# EAGLE design v1 USB_UART (EAGLE 9.7.0)
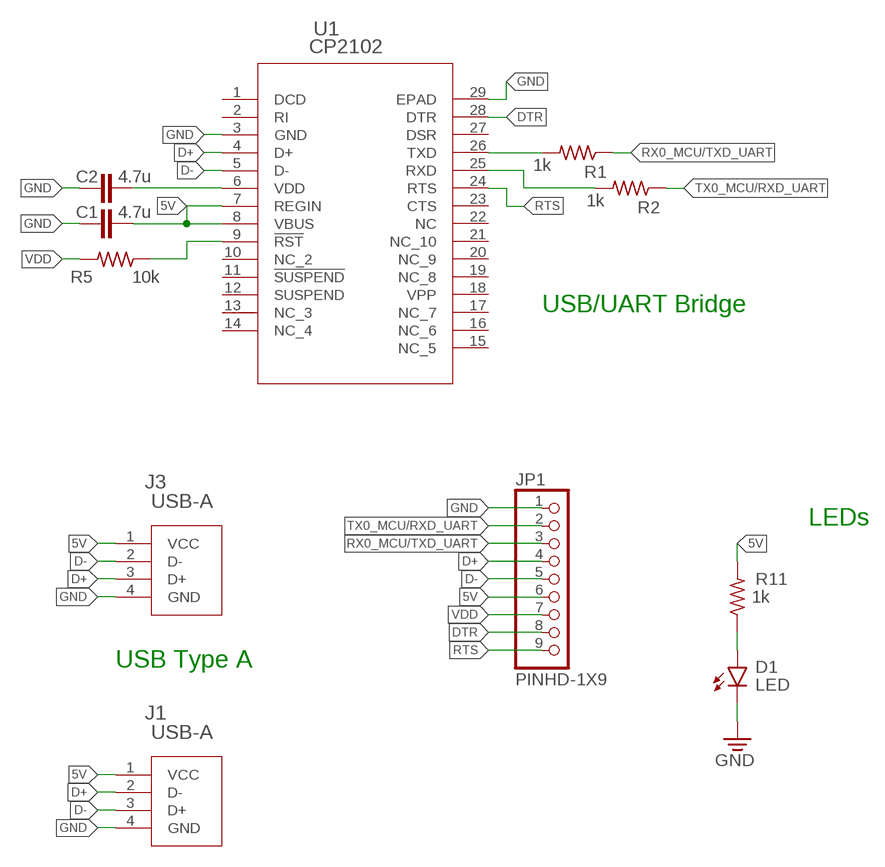
[diagram p0: schematic, sheet 1]

## Parts
C1  4.7u  C_CHIP-0805(2012-METRIC)  [CAPC2012X110]
C2  4.7u  C_CHIP-0805(2012-METRIC)  [CAPC2012X110]
D1  LED  CHIP-FLAT-B_0805  [LEDC2012X110N_FLAT-B]
J1  USB-A  USB-A1VSB6_OST  [USB-A]
J3  USB-A  USB-A1VSB6_OST  [USB-A]
JP1  PINHD-1X9  [1X09]
R1  1k  R-US_CHIP-0805(2012-METRIC)  [RESC2012X65]
R2  1k  R-US_CHIP-0805(2012-METRIC)  [RESC2012X65]
R5  10k  R-US_CHIP-0805(2012-METRIC)  [RESC2012X65]
R11  1k  R-US_CHIP-0805(2012-METRIC)  [RESC2012X65]
U1  CP2102  CP2102-GMQFN28_5X5_SIL  [QFN28_5X5_SIL]

## Nets
5V: C1.2 J1.1(VCC) J3.1(VCC) JP1.6 R11.2 U1.7(REGIN) U1.8(VBUS)
D+: J1.2(D-) J3.3(D+) JP1.4 U1.4(D+)
D-: J1.3(D+) J3.2(D-) JP1.5 U1.5(D-)
DTR: JP1.8 U1.28(DTR)
GND: C1.1 C2.1 D1.C J1.4(GND) J3.4(GND) JP1.1 U1.3(GND) U1.29(EPAD)
N$1: D1.A R11.1
N$5: R5.1 U1.9(!RST)
RTS: JP1.9 U1.24(RTS)
RX0_MCU/TXD_UART: JP1.3 R1.1
RXD: R2.2 U1.25(RXD)
TX0_MCU/RXD_UART: JP1.2 R2.1
TXD: R1.2 U1.26(TXD)
VDD: C2.2 JP1.7 R5.2 U1.6(VDD)
Unconnected: U1.1(DCD) U1.2(RI) U1.10(NC_2) U1.11(!SUSPEND) U1.12(SUSPEND) U1.13(NC_3) U1.14(NC_4) U1.15(NC_5) U1.16(NC_6) U1.17(NC_7) U1.18(VPP) U1.19(NC_8) U1.20(NC_9) U1.21(NC_10) U1.22(NC) U1.23(CTS) U1.27(DSR)

## Notes on the sheet
- USB/UART Bridge
- LEDs
- USB Type A

## Library data of the parts
C1 C2 = Capacitor:C: Capacitor - Generic; CATEGORY: Capacitor
D1 = LED:CHIP-FLAT-B; CATEGORY: LED; COLOR: BLUE; DESCRIPTION: CHIP LED FLAT; SUB-CATEGORY: CHIP; TYPE: FLAT_TOP; VALUE: LED_BLUE
J1 J3 = SD-SolderSync-Library:USB-A; COPYRIGHT: Copyright (C) 2025 Ultra Librarian. All rights reserved.; MANUFACTURER_PART_NUMBER: USB-A1VSB6; MFR_NAME: On Shore Technology
JP1 = Connector:PINHD-1X9: PIN HEADER; CATEGORY: Headers; DESCRIPTION: Header-Straight-9 Position; PACKAGE_TYPE: THT; PITCH: 0.100" (2.54mm); SUBCATEGORY: Headers-Male Pins; TYPE: Board to Board or Cable-Unshrouded-Through Hole-Straight
R1 R2 R5 R11 = Resistor:R-US: Resistor Fixed - ANSI; CATEGORY: Resistor; SUB-CATEGORY: Fixed
U1 = SD-SolderSync-Library:CP2102-GM; COPYRIGHT: Copyright (C) 2025 Ultra Librarian. All rights reserved.; MANUFACTURER_PART_NUMBER: CP2102-GM; MFR_NAME: Silicon Labs

## Board
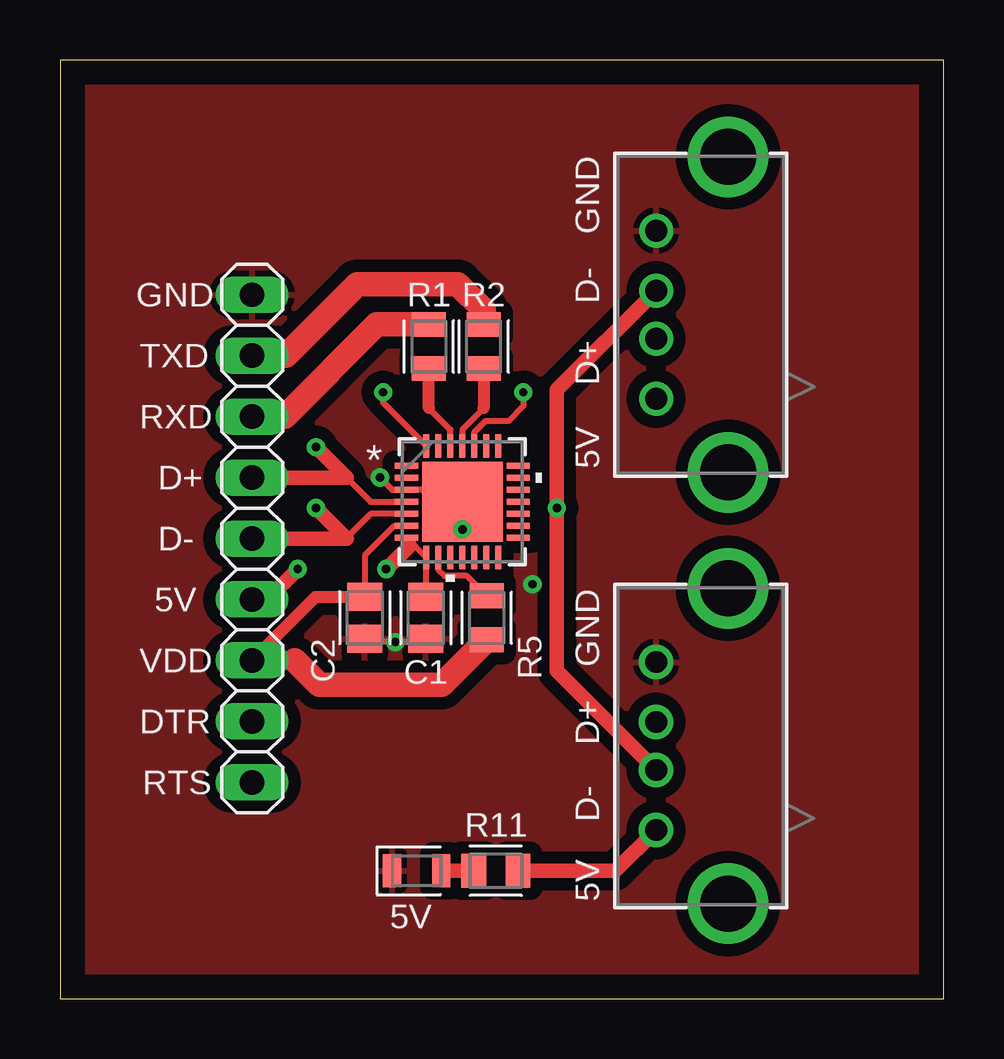
[diagram p1: board, top side]
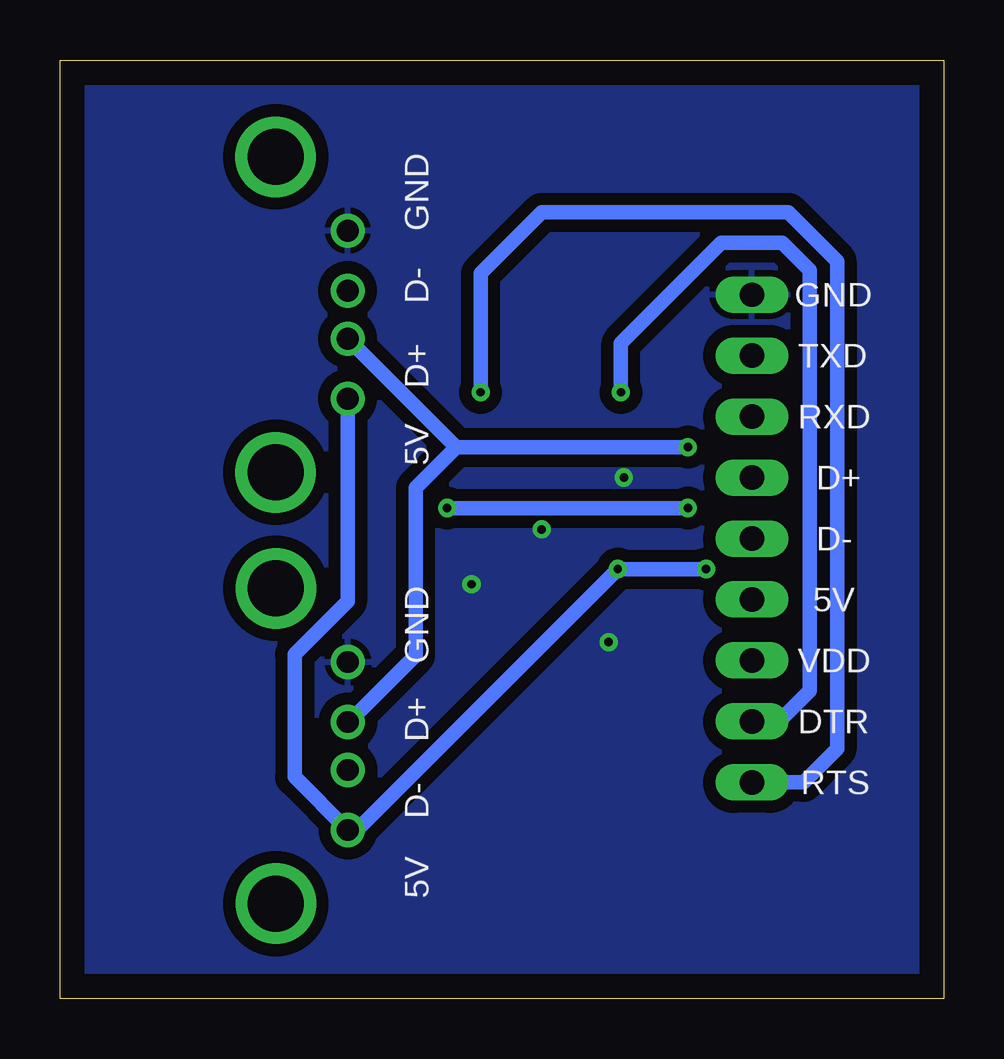
[diagram p2: board, bottom side, seen from below]

Size 36.83 x 39.12 mm. Coordinates in mm from the lower left corner, seen from the top.
Outline: 0,0 36.83,0 36.83,39.12 0,39.12 0,0
Copper layers (1*16): Top 0.035mm / dielectric 1.5mm / Bottom 0.035mm
Design rules "Fusion Electronics Design Rules": minimum track width 6mil, minimum drill 0.35mm, track to track 6mil, track to pad 6mil, pad to pad 6mil, via to via 6mil, smd to smd 6mil, copper to edge 40mil, drill to drill 6mil, minimum pad ring 10mil, minimum via ring 8mil, stop-mask expansion 4mil, vias tented up to drill 0mil, thermal gap 10mil

### Footprints (pad centres in the part's own frame; a part is rotated, then mirrored left to right if it is on the bottom)
CAPC2012X110 = smd 1.165 x 1.465: 1 -0.875,0; 2 0.875,0
LEDC2012X110N_FLAT-B = smd 0.762 x 1.362: A 1.025,0; C -1.025,0
USB-A = drill 0.914 pad 1.422: 1 0,0; 2 2.5,0; 3 4.5,0; 4 7,0 | drill 2.337 pad 2.845: 6 -3.07,-3; 7 10.07,-3
1X09 = drill 1.016 long: 1 -10.16,0; 2 -7.62,0; 3 -5.08,0; 4 -2.54,0; 5 0,0; 6 2.54,0; 7 5.08,0; 8 7.62,0; 9 10.16,0
RESC2012X65 = smd 1.031 x 1.42: 1 -0.919,0; 2 0.919,0
QFN28_5X5_SIL = smd 0.965 x 0.254: 1 -2.324,1.5; 2 -2.324,1; 3 -2.324,0.5; 4 -2.324,0; 5 -2.324,-0.5; 6 -2.324,-1; 7 -2.324,-1.5; 15 2.324,-1.5; 16 2.324,-1; 17 2.324,-0.5; 18 2.324,0; 19 2.324,0.5; 20 2.324,1; 21 2.324,1.5 | smd 0.254 x 0.965: 8 -1.5,-2.324; 9 -1,-2.324; 10 -0.5,-2.324; 11 0,-2.324; 12 0.5,-2.324; 13 1,-2.324; 14 1.5,-2.324; 22 1.5,2.324; 23 1,2.324; 24 0.5,2.324; 25 0,2.324; 26 -0.5,2.324; 27 -1,2.324; 28 -1.5,2.324 | smd 3.353 x 3.353: 29 0,0

### Placement (x,y rotation side)
C1  15.24,15.88 90 top
C2  12.7,15.88 90 top
D1  14.86,5.33 0 top
J1  24.84,25.01 90 top
J3  24.84,7.03 90 top
JP1  8,19.18 270 top
R1  15.37,27.18 270 top
R2  17.65,27.18 270 top
R5  17.78,15.88 270 top
R11  18.16,5.33 0 top
U1  16.76,20.71 0 top

### Tracks (layer width: path | path; a pad name or v marks a point on that pad's centre or on a via)
5V  (via drill 0.35)
  Top 0.254: C1.2 15.26,16.77 U1.8 U1.7 14.57,19.08 14.57,18.88
  Top 0.61: v9.91,17.91 8.64,16.64 JP1.6 | v13.59,17.91 14.57,18.88 | R11.2 23.14,5.33 J3.1
  Bottom 0.61: v9.91,17.91 v13.59,17.91 24.46,7.03 J3.1 27.05,9.25 27.05,14.35 24.84,16.56 J1.1
D+  (via drill 0.35)
  Top 0.254: U1.4 12.95,20.71 11.94,21.72
  Top 0.61: JP1.4 11.94,21.72 v10.67,22.99
  Bottom 0.61: 20.32,22.99 J1.2 | 20.32,22.99 v10.67,22.99 | J3.3 24.79,11.53 22.02,14.31 22.02,21.29 20.32,22.99
D-  (via drill 0.35)
  Top 0.254: U1.5 12.95,20.21 11.94,19.2 11.94,19.18
  Top 0.61: JP1.5 11.94,19.18 v10.67,20.45 | J3.2 20.7,13.67 v20.7,20.45 20.7,25.37 J1.3
  Bottom 0.61: v20.7,20.45 v10.67,20.45
DTR  (via drill 0.35)
  Top 0.254: U1.28 13.46,24.84 v13.46,25.27
  Bottom 0.61: v13.46,25.27 13.46,27.3 9.27,31.5 6.73,31.5 5.59,30.35 5.59,12.83 6.86,11.56 JP1.8
GND  (via drill 0.35)
  Top 0.254: v13.34,21.72 13.84,21.21 U1.3 15.33,21.21 | C2.1 12.83,14.87 13.96,14.87 v13.97,14.86 15.1,14.86 C1.1
  Top 0.508: U1.29 v16.76,19.56
  Top 0.61: U1.29 15.83,20.71 15.33,21.21
  other vias: 19.68,17.27
  pour Bottom (isolate 0.508): 1.07,-3.3 37.79,-3.3 41.91,0.81 41.91,35.89 36.9,40.89 0.18,40.89 -3.94,36.78 -3.94,1.7
  pour Top (isolate 0.508): 1.58,-2.03 37.54,-2.03 40.77,1.2 40.77,35.25 36.14,39.88 0.56,39.88 -2.54,36.78 -2.54,2.08
N$1
  Top 0.61: D1.A R11.1
N$5
  Top 0.254: R5.1 16.95,17.62 16.02,17.62 15.76,17.88 U1.9
RTS  (via drill 0.35)
  Top 0.254: U1.24 17.26,23.61 17.72,24.07 18.69,24.07 19.3,24.69 v19.3,25.27
  Bottom 0.61: v19.3,25.27 19.3,30.23 16.76,32.77 6.48,32.77 4.45,30.73 4.45,10.41 5.84,9.02 JP1.9
RX0_MCU/TXD_UART
  Top 1.016: R1.1 13.21,28.1 9.37,24.26 JP1.3
RXD
  Top 0.254: 17.65,24.61 16.76,23.72 U1.25
  Top 0.508: R2.2 17.65,24.61
TX0_MCU/RXD_UART
  Top 1.016: JP1.2 9.4,26.8 12.38,29.78 16.57,29.78 17.65,28.7 R2.1
TXD
  Top 0.254: 15.37,24.61 16.26,23.71 U1.26
  Top 0.508: 15.37,24.61 R1.2
VDD
  Top 0.254: U1.6 13.94,19.71 12.7,18.48 C2.2
  Top 0.508: C2.2 10.65,16.75 JP1.7 9.78,14.1
  Top 1.016: 9.78,14.1 10.79,13.08 15.91,13.08 R5.2

### Text on the board
tPlace: GND | D- | GND | D+ | TXD | RXD | 5V | D+ | D- | 5V | GND | VDD | D+ | DTR | D- | RTS | 5V | 5V
bPlace: GND | D- | GND | D+ | TXD | RXD | 5V | D+ | D- | 5V | GND | VDD | D+ | DTR | D- | RTS | 5V